# EAGLE design NicoLase Arduino Shield (EAGLE 9.5.1)
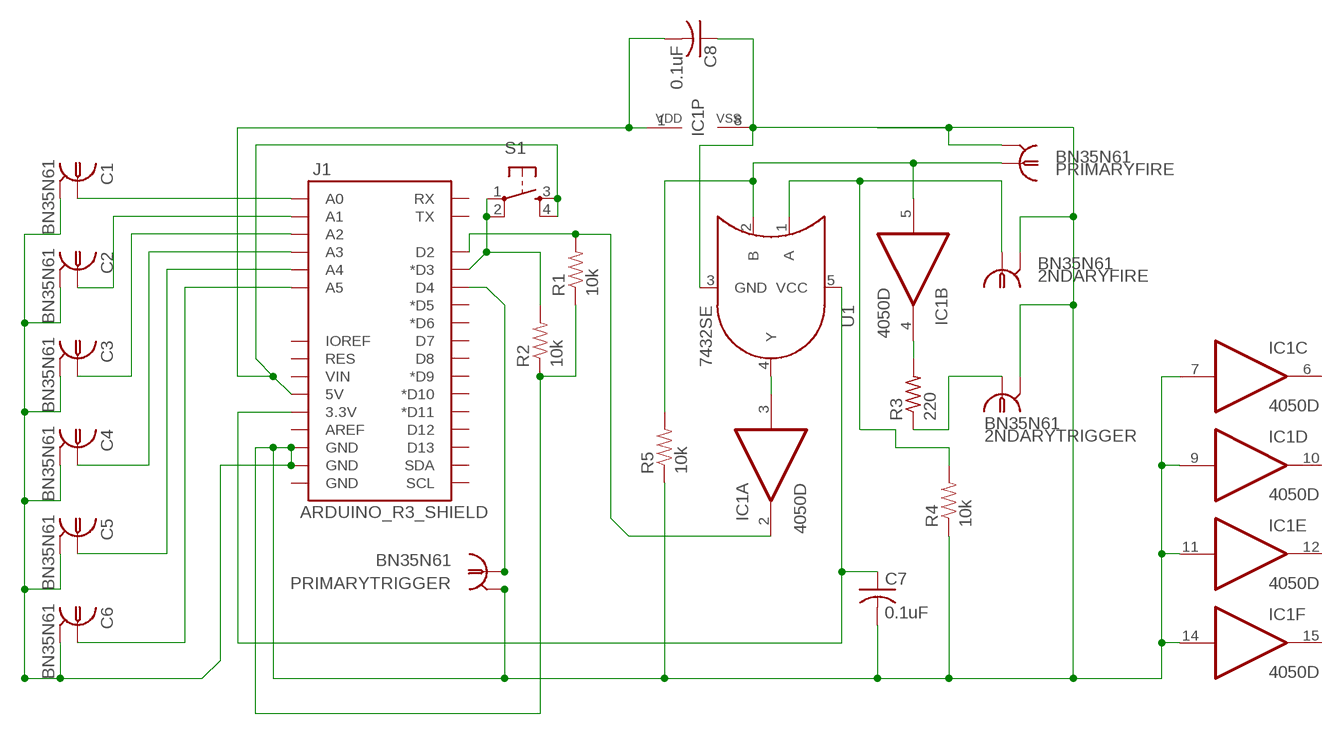
[diagram p0: schematic, sheet 1]

## Parts
2NDARYFIRE  BN35N61  [B35N61]
2NDARYTRIGGER  BN35N61  [B35N61]
C1  BN35N61  [B35N61]
C2  BN35N61  [B35N61]
C3  BN35N61  [B35N61]
C4  BN35N61  [B35N61]
C5  BN35N61  [B35N61]
C6  BN35N61  [B35N61]
C7  0.1uF  C-USC1206  [C1206]
C8  0.1uF  C-USC1206  [C1206]
IC1  4050D  [SO16]
J1  ARDUINO_R3_SHIELD  [UNO_R3_SHIELD]
PRIMARYFIRE  BN35N61  [B35N61]
PRIMARYTRIGGER  BN35N61  [B35N61]
R1  10k  RESISTOR1206  [1206]
R2  10k  RESISTOR1206  [1206]
R3  220  R-US_M1206  [M1206]
R4  10k  RESISTOR1206  [1206]
R5  10k  RESISTOR1206  [1206]
S1  TAC_SWITCHPTH  [TACTILE-PTH]
U1  7432SE  [SOT353]

## Nets
GND: 2NDARYFIRE.2 2NDARYFIRE.3 2NDARYFIRE.4 2NDARYFIRE.5 2NDARYTRIGGER.2 2NDARYTRIGGER.3 2NDARYTRIGGER.4 2NDARYTRIGGER.5 C1.2 C1.3 C1.4 C1.5 C2.2 C2.3 C2.4 C2.5 C3.2 C3.3 C3.4 C3.5 C4.2 C4.3 C4.4 C4.5 C5.2 C5.3 C5.4 C5.5 C6.2 C6.3 C6.4 C6.5 C7.2 C8.1 IC1.7(C:I) IC1.8(P:VSS) IC1.9(D:I) IC1.11(E:I) IC1.14(F:I) J1.GND@1(GND) J1.GND@2(GND) PRIMARYFIRE.2 PRIMARYFIRE.3 PRIMARYFIRE.4 PRIMARYFIRE.5 PRIMARYTRIGGER.2 PRIMARYTRIGGER.3 PRIMARYTRIGGER.4 PRIMARYTRIGGER.5 R1.1 R2.1 R4.1 R5.1 U1.3(GND)
N$1: C7.1 J1.3.3V U1.5(VCC)
N$3: C1.1 J1.A0
N$4: C2.1 J1.A1
N$5: C3.1 J1.A2
N$6: C4.1 J1.A3
N$7: C5.1 J1.A4
N$8: C6.1 J1.A5
N$10: IC1.3(A:I) U1.4(Y)
N$11: 2NDARYTRIGGER.1 R3.1
N$13: J1.D3(*D3) R2.2 S1.1 S1.2
N$15: IC1.4(B:O) R3.2
N$16: C8.2 IC1.1(P:VDD) J1.5V S1.3 S1.4
N$17: IC1.2(A:O) J1.D2 R1.2
N$19: J1.D4 PRIMARYTRIGGER.1
N$26: 2NDARYFIRE.1 R4.2 U1.1(A)
SLAVEFIRE: IC1.5(B:I) PRIMARYFIRE.1 R5.2 U1.2(B)
Unconnected: IC1.6(C:O) IC1.10(D:O) IC1.12(E:O) IC1.15(F:O) J1.AREF J1.D5(*D5) J1.D6(*D6) J1.D7 J1.D8 J1.D9(*D9) J1.D10(*D10) J1.D11(*D11) J1.D12 J1.D13 J1.GND@0(GND) J1.IOREF J1.RES J1.RX J1.SCL J1.SDA J1.TX J1.VIN

## Library data of the parts
2NDARYFIRE 2NDARYTRIGGER C1-C6 PRIMARYFIRE PRIMARYTRIGGER = con-coax:BN35N61: BNC CONNECTOR M/A COM www.macom.com distributor Farnell 149-452; OC_FARNELL: unknown; OC_NEWARK: unknown
C7 C8 = rcl:C-US: CAPACITOR, American symbol; SPICEPREFIX: C
IC1 = 40xx:4050: Hex non-inverting BUFFER
J1 = SparkFun-Boards:ARDUINO_R3_SHIELD: Shield form compatible with the Arduino Uno R3.
R1 R4 R5 = SparkFun-Resistors:RESISTOR: Resistor Basic schematic elements and footprints for 0603, 1206, and PTH resistors.
R2 = SparkFun-Passives:RESISTOR: Resistor Basic schematic elements and footprints for 0603, 1206, and PTH resistors.
R3 = resistor:R-US_: RESISTOR, American symbol
S1 = SparkFun-Retired:TAC_SWITCH: Momentary Switch Button commonly used for reset or general input. Spark Fun Electronics SKU : COM-00097 SMT- SWCH-08247
U1 = SparkFun-DigitalIC:74*32: Single 2-input OR gate; PROD_ID: IC-10842

## Board
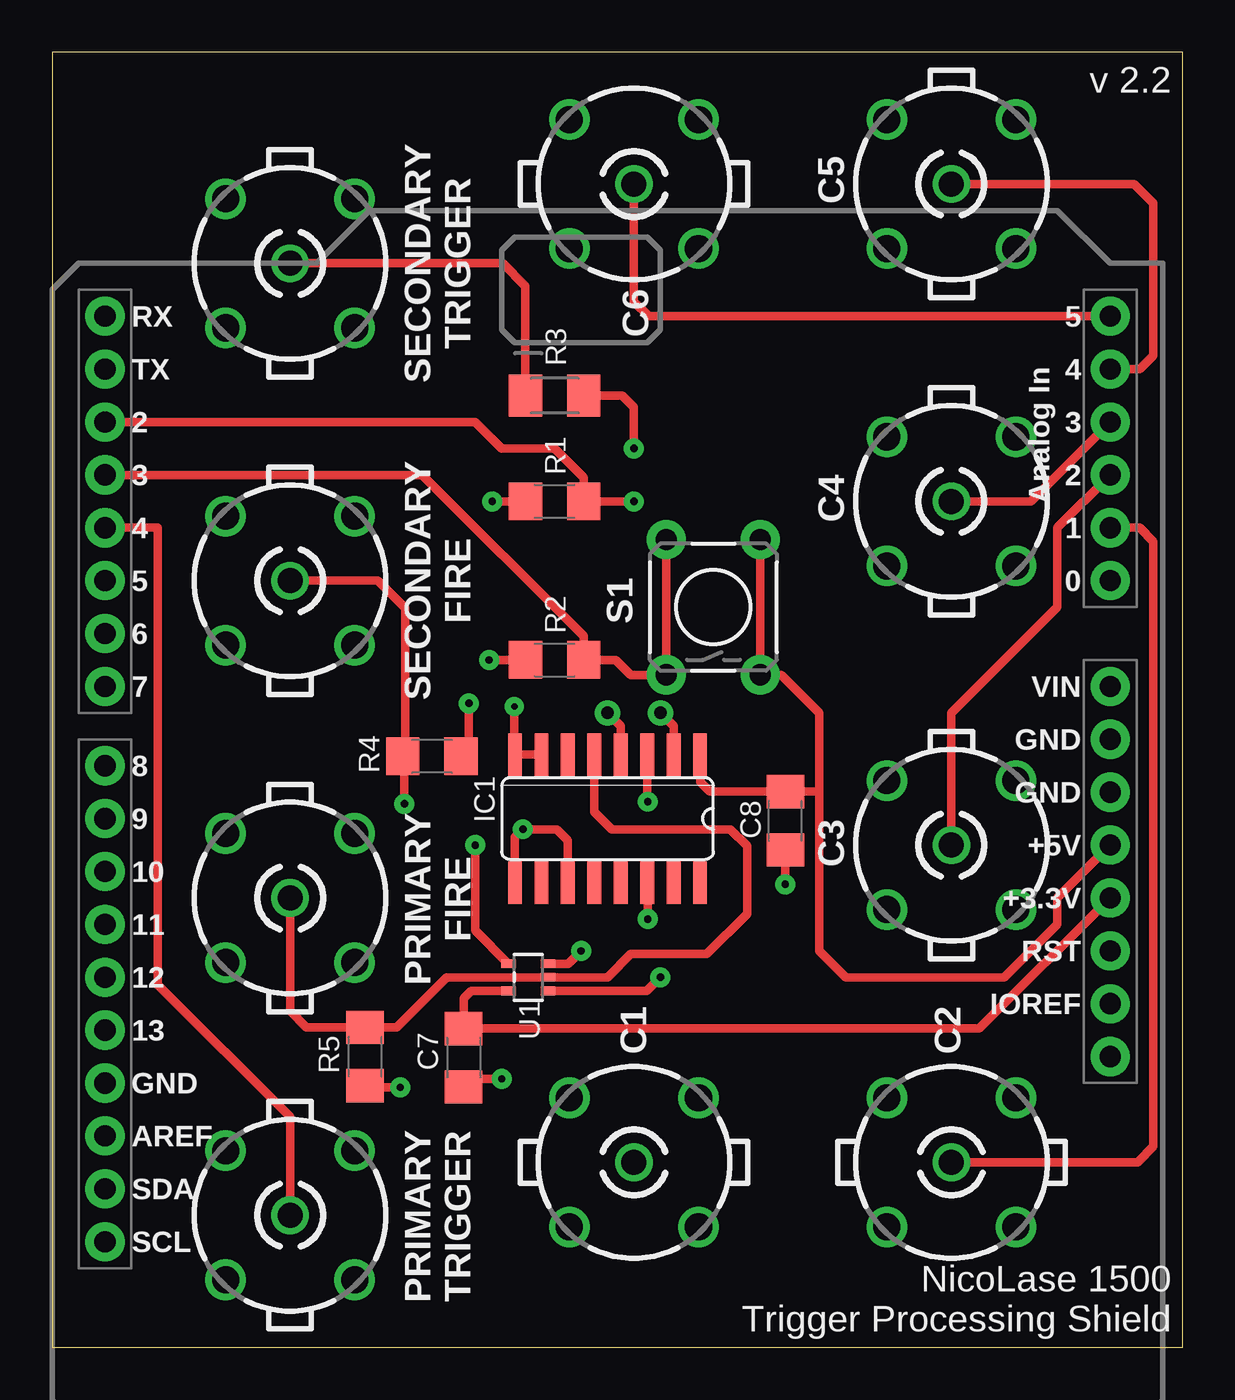
[diagram p1: board, top side]
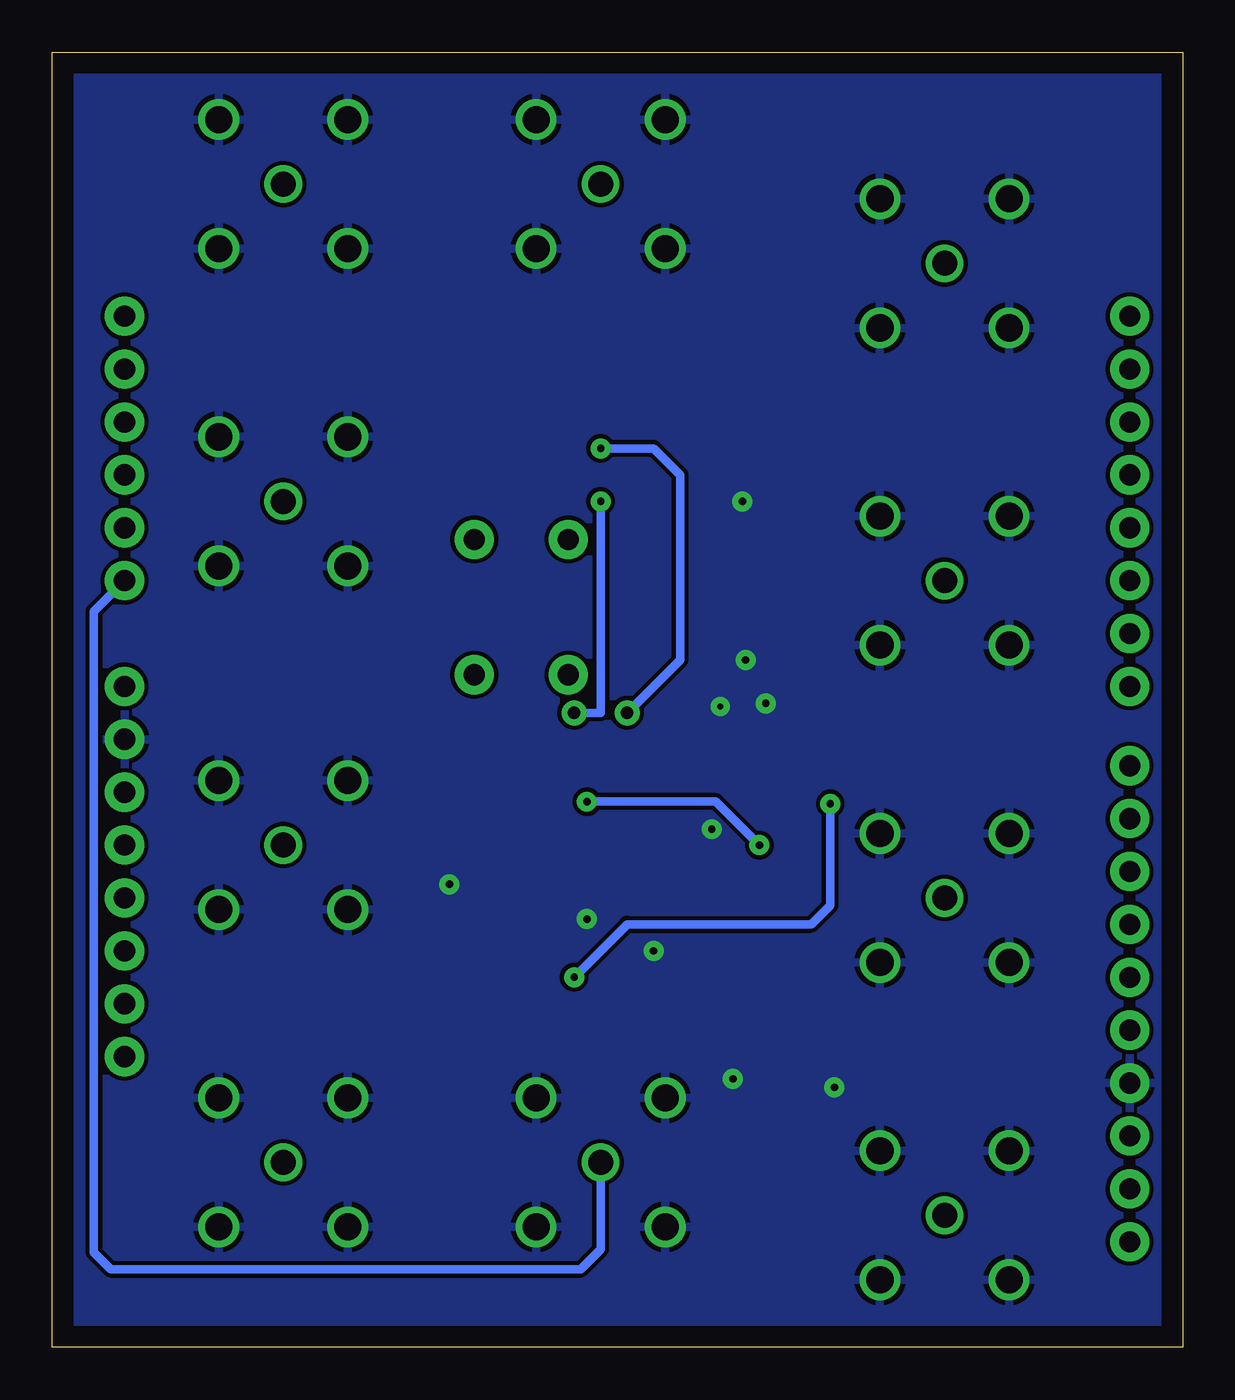
[diagram p2: board, bottom side, seen from below]

Size 54.28 x 62.22 mm. Coordinates in mm from the lower left corner, seen from the top.
Outline: 0,0 54.28,0 54.28,62.22 0,62.22 0,0
Copper layers (1*16): Top 0.035mm / dielectric 1.5mm / Bottom 0.035mm
Design rules "default *": minimum track width 12mil, minimum drill 0.3mm, track to track 8mil, track to pad 8mil, pad to pad 8mil, via to via 8mil, smd to smd 8mil, copper to edge 40mil, drill to drill 8mil, minimum pad ring 12mil, minimum via ring 12mil, stop-mask expansion 2mil, vias tented up to drill 0.35mm, thermal gap 10mil

### Footprints (pad centres in the part's own frame; a part is rotated, then mirrored left to right if it is on the bottom)
B35N61 = drill 1.2: 1 0,0 | drill 1.3: 2 3.099,3.099; 3 -3.099,3.099; 4 -3.099,-3.099; 5 3.099,-3.099
C1206 = smd 1.6 x 1.8: 1 -1.4,0; 2 1.4,0
SO16 = smd 0.66 x 2.032: 1 -4.445,-3.073; 2 -3.175,-3.073; 3 -1.905,-3.073; 4 -0.635,-3.073; 5 0.635,-3.073; 6 1.905,-3.073; 7 3.175,-3.073; 8 4.445,-3.073; 9 4.445,3.073; 10 3.175,3.073; 11 1.905,3.073; 12 0.635,3.073; 13 -0.635,3.073; 14 -1.905,3.073; 15 -3.175,3.073; 16 -4.445,3.073
UNO_R3_SHIELD = drill 1.016 pad 1.88: 3.3V 50.8,26.67; 5V 50.8,29.21; A0 50.8,41.91; A1 50.8,44.45; A2 50.8,46.99; A3 50.8,49.53; A4 50.8,52.07; A5 50.8,54.61; AREF 2.54,15.24; D2 2.54,49.53; D3 2.54,46.99; D4 2.54,44.45; D5 2.54,41.91; D6 2.54,39.37; D7 2.54,36.83; D8 2.54,33.02; D9 2.54,30.48; D10 2.54,27.94; D11 2.54,25.4; D12 2.54,22.86; D13 2.54,20.32; GND@0 50.8,31.75; GND@1 50.8,34.29; GND@2 2.54,17.78; IOREF 50.8,21.59; NC 50.8,19.05; RES 50.8,24.13; RX 2.54,54.61; SCL 2.54,10.16; SDA 2.54,12.7; TX 2.54,52.07; VIN 50.8,36.83
1206 = smd 1.6 x 1.8: 1 -1.4,0; 2 1.4,0
M1206 = smd 1.6 x 2: 1 -1.4,0; 2 1.4,0
TACTILE-PTH = drill 1.016 pad 1.88: 1 -3.251,2.261; 2 3.251,2.261; 3 -3.251,-2.261; 4 3.251,-2.261
SOT353 = smd 0.42 x 0.7: 1 -0.65,-0.95; 2 0,-0.95; 3 0.65,-0.95; 4 0.65,0.95; 5 -0.65,0.95

### Placement (x,y rotation side)
2NDARYFIRE  11.43,36.83 270 top
2NDARYTRIGGER  11.43,52.07 270 top
C1  27.94,8.89 0 top
C2  43.18,8.89 0 top
C3  43.18,24.13 90 top
C4  43.18,40.64 90 top
C5  43.18,55.88 90 top
C6  27.94,55.88 0 top
C7  19.76,13.92 270 top
C8  35.2,25.3 90 top
IC1  26.67,25.4 180 top
J1  0,-5.08 0 top
PRIMARYFIRE  11.43,21.59 270 top
PRIMARYTRIGGER  11.43,6.35 270 top
R1  24.13,40.64 0 top
R2  24.13,33.02 0 top
R3  24.13,45.72 0 top
R4  18.24,28.4 180 top
R5  15.04,13.97 90 top
S1  31.75,35.56 90 top
U1  22.86,17.78 90 top

### Tracks (layer width: path | path; a pad name or v marks a point on that pad's centre or on a via)
GND  (via drill 0.3, 0.35)
  Top 0.406: 22.23,32.52 R2.1 | U1.3 24.78,18.43 v25.4,19.05 | 14.91,12.7 R5.1 15.11,12.5 v16.71,12.5 | 22.86,33.15 R2.1 | R2.1 v20.98,33.02 | R4.1 20.02,28.78 v20.02,30.94 | R1.1 v21.13,40.64 | v22.2,30.79 22.2,28.5 IC1.8 IC1.7 | C7.2 20.14,12.9 v21.59,12.9 | C8.1 v35.2,22.25 | IC1.9 22.23,24.51 v22.61,24.89 24.23,24.89 24.77,24.36 IC1.11 | v28.6,20.57 28.6,22.3 IC1.14
  pour Bottom: 0.05,0.05 54.15,0.05 54.15,62.18 0.05,62.18
N$1
  Top 0.406: J1.3.3V 44.53,15.32 C7.1 19.76,16.76 20.13,17.13 U1.5
N$3
  Bottom 0.406: J1.A0 52.27,35.36 52.27,4.57 51.46,3.76 28.91,3.76 27.94,4.72 C1.1
N$4
  Top 0.406: J1.A1 52.22,39.37 52.88,38.71 52.88,9.65 52.12,8.89 C2.1
N$5
  Top 0.406: J1.A2 48.26,39.37 48.26,35.56 43.18,30.48 C3.1
N$6
  Top 0.406: C4.1 46.99,40.64 J1.A3
N$7
  Top 0.406: J1.A4 52.22,46.99 52.88,47.65 52.88,54.97 51.97,55.88 C5.1
N$8
  Top 0.406: C6.1 27.94,50.24 28.65,49.53 J1.A5
N$10  (via drill 0.35)
  Top 0.406: v28.6,26.21 28.57,26.24 IC1.3 | v20.32,24.13 20.32,20.02 U1.4
  Bottom 0.406: v20.32,24.13 22.4,26.21 v28.6,26.21
N$11
  Top 0.406: R3.1 22.73,50.98 21.64,52.07 2NDARYTRIGGER.1
N$13
  Top 0.406: J1.D3 17.78,41.91 25.53,34.16 R2.2 27.08,33.02 27.79,32.31 S1.1 S1.2
N$15  (via drill 0.35, 0.6)
  Top 0.406: IC1.4 27.3,29.85 v26.67,30.48 | R3.2 27.38,45.72 27.94,45.16 v27.94,43.18
  Bottom 0.406: v26.67,30.48 24.13,33.02 24.13,41.91 25.4,43.18 v27.94,43.18
N$16
  Top 0.406: 36.83,26.72 36.83,19.05 38.1,17.78 45.72,17.78 48.26,20.32 48.26,21.59 J1.5V | 36.83,26.72 36.83,30.48 35,32.31 S1.3 | S1.4 S1.3 | S1.3 34.01,32.03 34.29,31.75 34.29,32.03 S1.3 | 36.83,26.72 36.81,26.7 C8.2 31.57,26.7 31.11,27.15 IC1.1
N$17  (via drill 0.35, 0.6)
  Top 0.406: J1.D2 20.32,44.45 21.59,43.18 24.13,43.18 25.53,41.78 R1.2 v27.94,40.64 | v29.21,30.48 29.85,29.85 IC1.2
  Bottom 0.406: v27.94,40.64 27.94,30.48 v29.21,30.48
N$19
  Top 0.406: J1.D4 5.08,39.37 5.08,17.42 11.43,11.07 PRIMARYTRIGGER.1
N$26  (via drill 0.35)
  Top 0.406: 2NDARYFIRE.1 15.65,36.83 16.97,35.51 16.97,28.53 16.92,28.48 | R4.2 16.92,28.48 | U1.1 28.56,17.13 v29.21,17.78 | v16.92,26.11 16.92,28.48
  Bottom 0.406: v29.21,17.78 26.67,20.32 17.83,20.32 16.92,21.23 v16.92,26.11
SLAVEFIRE
  Top 0.406: PRIMARYFIRE.1 11.43,16.15 12.21,15.37 R5.2 16.54,15.37 18.95,17.78 U1.2 26.67,17.78 27.79,18.9 31.45,18.9 33.38,20.83 33.38,24.08 32.56,24.89 26.87,24.89 26.04,25.73 IC1.5

### Text on the board
tPlace: v 2.2 | SECONDARY / TRIGGER | SECONDARY / FIRE | PRIMARY / FIRE | PRIMARY / TRIGGER | NicoLase 1500 / Trigger Processing Shield